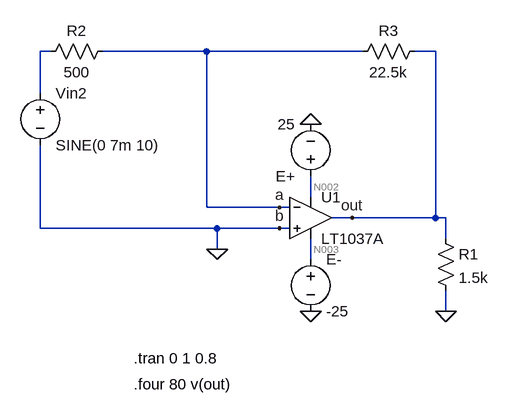
[diagram p0: schematic 3.1.asc]
3.1.asc, the LTspice schematic file:
Version 4
SHEET 1 880 680
WIRE -128 -288 -144 -288
WIRE 112 -288 -48 -288
WIRE 352 -288 112 -288
WIRE 464 -288 432 -288
WIRE -144 -224 -144 -288
WIRE 272 -64 272 -96
WIRE 112 -48 112 -288
WIRE 224 -48 112 -48
WIRE 240 -48 224 -48
WIRE 336 -32 304 -32
WIRE 464 -32 464 -288
WIRE 464 -32 336 -32
WIRE 480 -32 464 -32
WIRE -144 -16 -144 -144
WIRE 128 -16 -144 -16
WIRE 224 -16 128 -16
WIRE 240 -16 224 -16
WIRE 480 0 480 -32
WIRE 128 16 128 -16
WIRE 272 32 272 0
WIRE 480 112 480 80
FLAG 272 112 0
FLAG 272 -176 0
FLAG 480 112 0
FLAG 224 -48 a
FLAG 224 -16 b
FLAG 336 -32 out
FLAG 128 16 0
SYMBOL Opamps\\LT1037A 272 -96 R0
SYMATTR InstName U1
SYMBOL voltage -144 -240 R0
WINDOW 123 0 0 Left 2
WINDOW 39 0 0 Left 2
SYMATTR InstName Vin2
SYMATTR Value SINE(0 7m 10)
SYMBOL voltage 272 -80 R180
WINDOW 123 0 0 Left 2
WINDOW 39 0 0 Left 2
SYMATTR InstName E+
SYMATTR Value 25
SYMBOL voltage 272 16 R0
WINDOW 123 0 0 Left 2
WINDOW 39 0 0 Left 2
SYMATTR InstName E-
SYMATTR Value -25
SYMBOL res -32 -304 R90
WINDOW 0 0 56 VBottom 2
WINDOW 3 32 56 VTop 2
SYMATTR InstName R2
SYMATTR Value 500
SYMBOL res 448 -304 R90
WINDOW 0 0 56 VBottom 2
WINDOW 3 32 56 VTop 2
SYMATTR InstName R3
SYMATTR Value 22.5k
SYMBOL res 464 -16 R0
SYMATTR InstName R1
SYMATTR Value 1.5k
TEXT 0 184 Left 2 !.tran 0 1 0.8
TEXT 0 224 Left 2 !.four 80 v(out)

The netlist it stands for:
* 3.1.asc
XU1 0 a N002 N003 out LT1037A  ; pins In+ In- V+ V- OUT
Vin2 N001 0 SINE(0 7m 10)
V§E+ N002 0 25
V§E- N003 0 -25
R2 a N001 500
R3 out a 22.5k
R1 out 0 1.5k
.tran 0 1 0.8
.four 80 v(out)
.backanno
.end

* Results of the author's LTspice run, read from the files saved beside the schematic
* Operating Point, zero values left out:
*   V(n002) = 25 V
*   V(n003) = -25 V
*   I(E-) = 2.666 mA
*   I(E+) = -2.666 mA
*   Ix(u1:3) = 2.666 mA
*   Ix(u1:4) = -2.666 mA
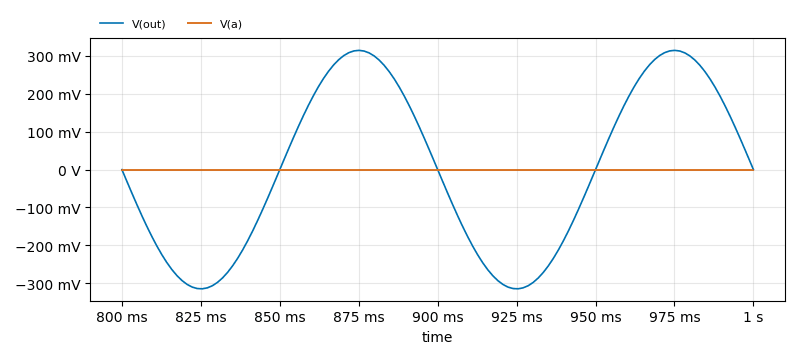
[diagram p1: Transient Analysis of 3.1.asc, plotted from the saved traces]
* Transient Analysis, 1 run:
*   V(out): min -314.7 mV, max 314.8 mV, average 70.47 nV, rms 222.6 mV, last 2.528 µV
*   V(a): min -57.56 nV, max 57.59 nV, average -790.4 fV, rms 40.72 nV, last 54.96 nV
* From the log:
*   N-Period=1
*   Fourier components of V(out)
*   DC component:0.117302
*   Harmonic  Frequency   Fourier   Normalized   Phase    Normalized
*    Number     [Hz]     Component   Component  [degree]  Phase [deg]
*       1     8.000e+01  7.201e-02  1.000e+00     -2.96°      0.00°
*       2     1.600e+02  3.555e-02  4.936e-01     -1.47°      1.49°
*       3     2.400e+02  2.364e-02  3.283e-01     -0.97°      1.99°
*       4     3.200e+02  1.772e-02  2.460e-01     -0.72°      2.24°
*       5     4.000e+02  1.417e-02  1.967e-01     -0.56°      2.40°
*       6     4.800e+02  1.180e-02  1.639e-01     -0.43°      2.53°
*       7     5.600e+02  1.012e-02  1.405e-01     -0.25°      2.71°
*       8     6.400e+02  8.907e-03  1.237e-01     -0.48°      2.48°
*       9     7.200e+02  7.871e-03  1.093e-01     -0.42°      2.54°
*   Total Harmonic Distortion: 72.423845%(79.129883%)